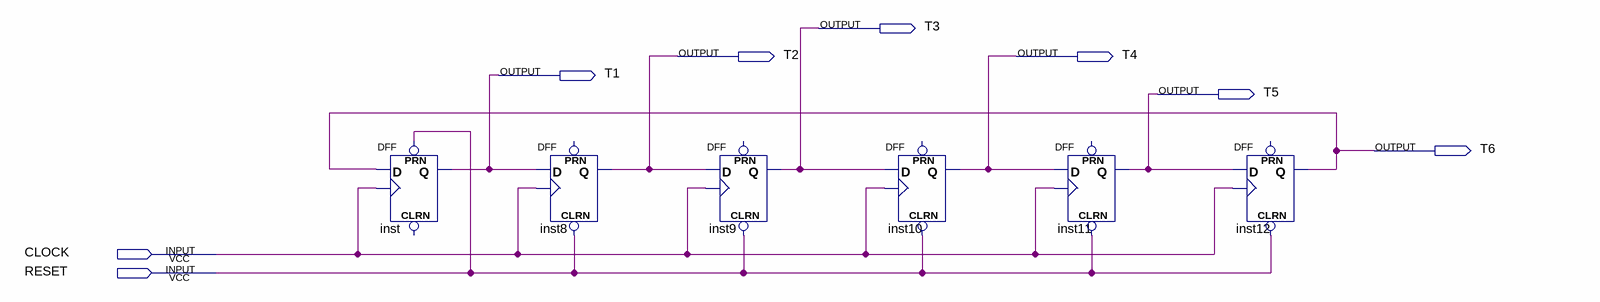
[diagram p0: schematic sheet]
// Quartus schematic Beater.bdf as structural Verilog: 6 symbols, 8 pins
module Beater (
  input  CLOCK,
  input  RESET,
  output T3,
  output T2,
  output T4,
  output T1,
  output T5,
  output T6
);

  DFF inst (.CLK(CLOCK), .D(T6), .PRN(RESET), .Q(T1));  // open: CLRN
  DFF inst8 (.CLRN(RESET), .CLK(CLOCK), .D(T1), .Q(T2));  // open: PRN
  DFF inst9 (.CLRN(RESET), .CLK(CLOCK), .D(T2), .Q(T3));  // open: PRN
  DFF inst10 (.CLRN(RESET), .CLK(CLOCK), .D(T3), .Q(T4));  // open: PRN
  DFF inst11 (.CLRN(RESET), .CLK(CLOCK), .D(T4), .Q(T5));  // open: PRN
  DFF inst12 (.CLRN(RESET), .CLK(CLOCK), .D(T5), .Q(T6));  // open: PRN
endmodule
